# EAGLE design shield (EAGLE 6.6.0)
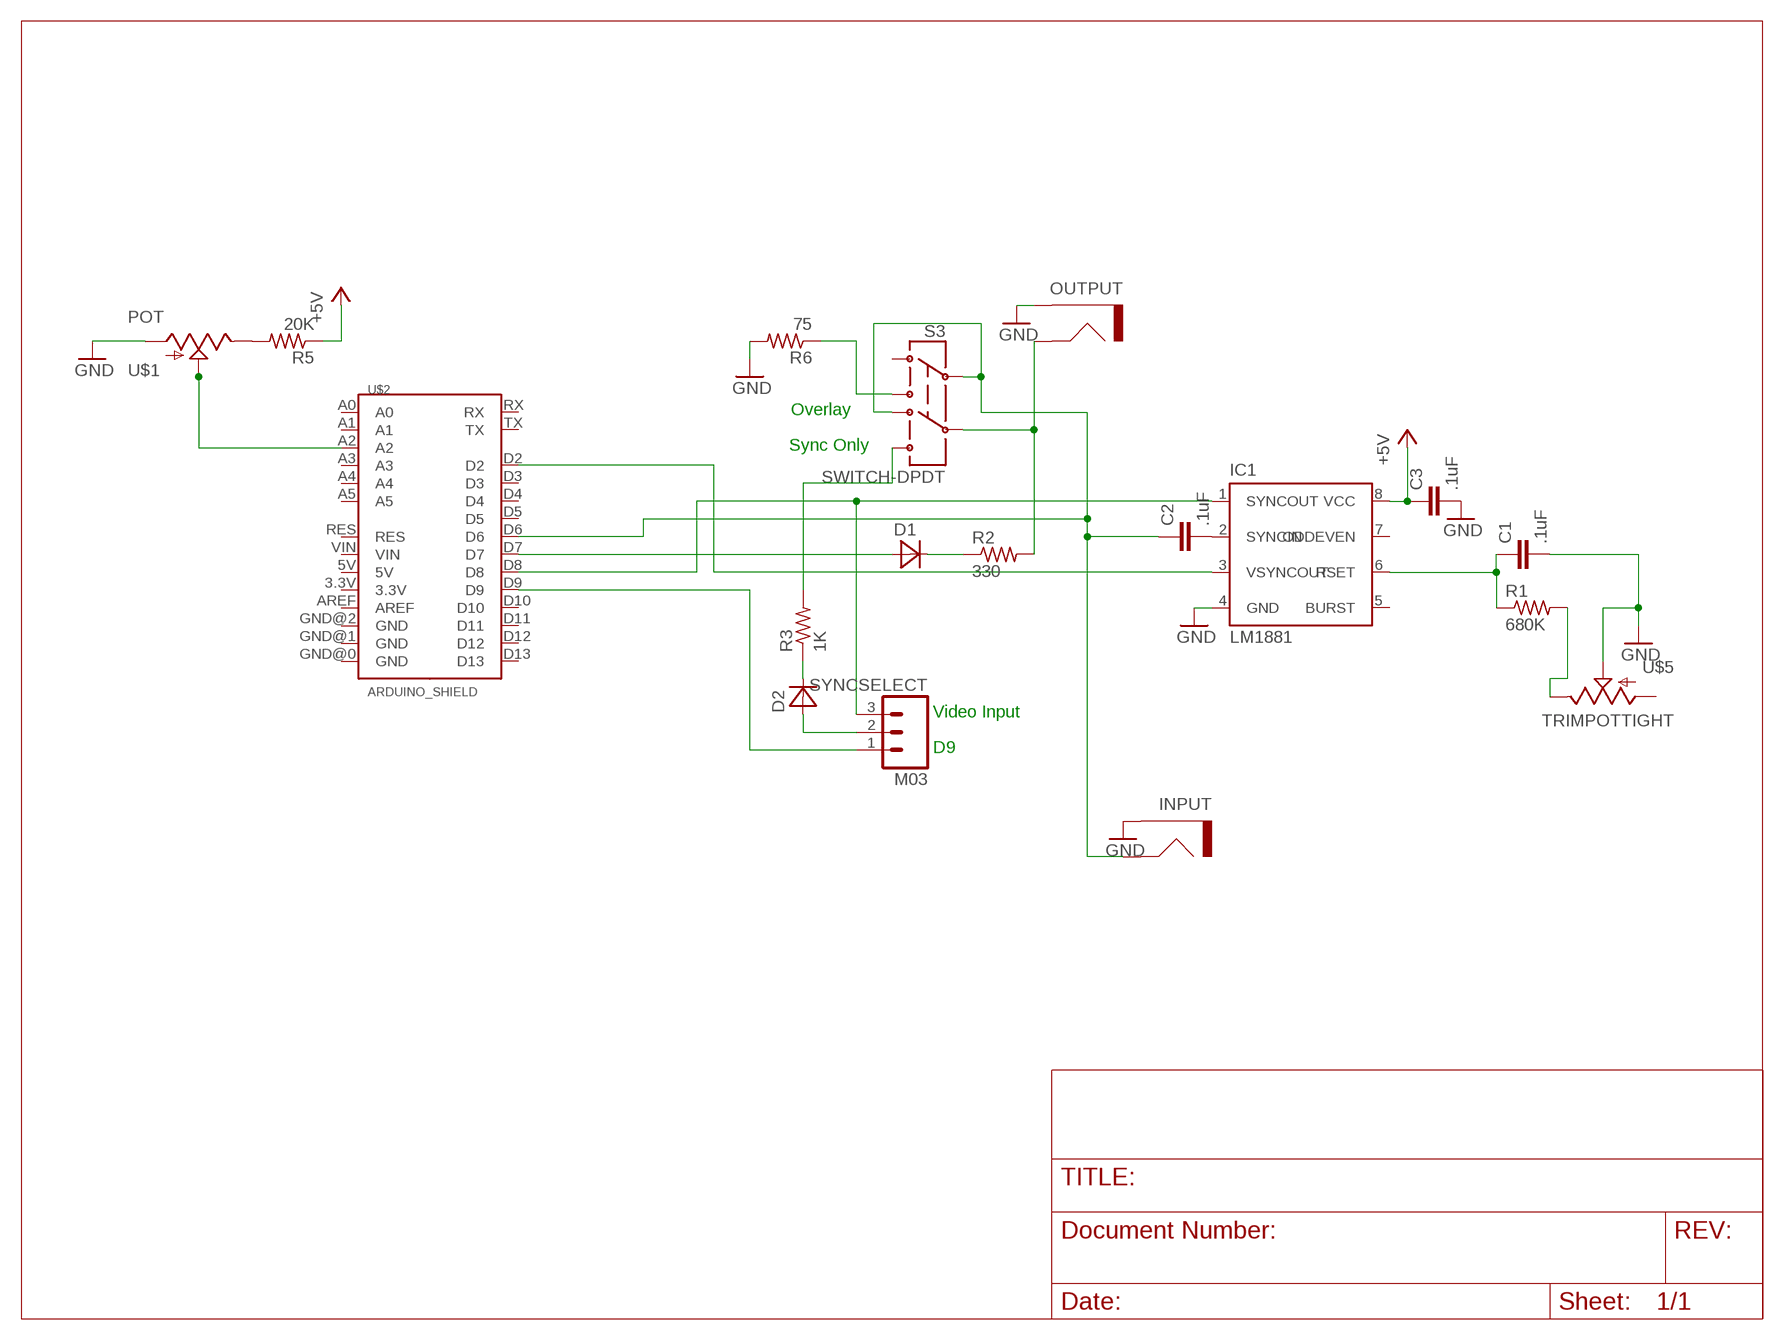
[diagram p0: schematic, sheet 1]
FRAME1 (LETTER_L): DRAWING_NAME: tidal-video-pulse

## Parts
C1  .1uF  CAPSMALL  [CAP-CERAMIC-SMALL]
C2  .1uF  CAPSMALL  [CAP-CERAMIC-SMALL]
C3  .1uF  CAPSMALL  [CAP-CERAMIC-SMALL]
D1  1N4148  [D35-10]
D2  1N4148  [D35-10]
IC1  LM1881  [DIL08]
INPUT  RCAJACK  [RCA]
OUTPUT  RCAJACK  [RCA]
R1  680K  R-US  [0207/10]
R2  330  R-US  [0207/10]
R3  1K  R-US  [0207/10]
R5  20K  R-US  [0207/10]
R6  75  R-US  [0207/10]
S3  SWITCH-DPDT  [OS]
SYNCSELECT  M03  [1X03]
U$1  POT  [TRIMMERPOT]
U$2  ARDUINO_SHIELD  [DUEMILANOVE_SHIELD]
U$5  TRIMPOTTIGHT  [TRIM_POT_TIGHT]

## Nets
+5V: C3.1 IC1.8(VCC) R5.1
A2: U$1.2(WIPER) U$1.4(WIPER) U$2.A2
D9: SYNCSELECT.1 U$2.D9
GND: C1.2 C3.2 IC1.4(GND) INPUT.BARREL(GND) OUTPUT.BARREL(GND) R6.2 U$1.1 U$5.2
N$1: R3.2 S3.6
N$2: R6.1 S3.3
N$3: D1.C R2.1
N$4: R1.2 U$5.3
N$5: R5.2 U$1.3
N$8: D2.C R3.1
N$13: D2.A SYNCSELECT.2
N$29: C2.2 IC1.2(SYNCIN)
RSET: C1.1 IC1.6(RSET) R1.1
SYNCOUT: IC1.1(SYNCOUT) SYNCSELECT.3 U$2.D8
VIDEOINPUT: C2.1 INPUT.P$2(SIGNAL) S3.2 S3.4 U$2.D6
VIDEOOUT: D1.A U$2.D7
VIDEOOUTPUT: OUTPUT.P$2(SIGNAL) R2.2 S3.5
VSYNC: IC1.3(VSYNCOUT) U$2.D2
Unconnected: IC1.5(BURST) IC1.7(ODDEVEN) S3.1 U$2.3.3V U$2.5V U$2.A0 U$2.A1 U$2.A3 U$2.A4 U$2.A5 U$2.AREF U$2.D3 U$2.D4 U$2.D5 U$2.D10 U$2.D11 U$2.D12 U$2.D13 U$2.GND@0(GND) U$2.GND@1(GND) U$2.GND@2(GND) U$2.RES U$2.RX U$2.TX U$2.VIN U$5.1

## Notes on the sheet
- Overlay
- Sync Only
- Video Input
- D9

## Library data of the parts
C1-C3 = nootropicdesign:CAP: Unpolarized capacitor
D1 D2 = nootropicdesign:1N4148
IC1 = lm1881:LM1881
INPUT OUTPUT = nootropicdesign:RCAJACK: RCA jack
R1-R3 R5 R6 = nootropicdesign:R-US: Resistor
S3 = nootropicdesign:SWITCH-DPDT: DPDT Version of the COM-00597
SYNCSELECT = nootropicdesign:M03
U$1 = nootropicdesign:POT
U$2 = nootropicdesign:ARDUINO_SHIELD
U$5 = nootropicdesign:TRIMPOT

## Board
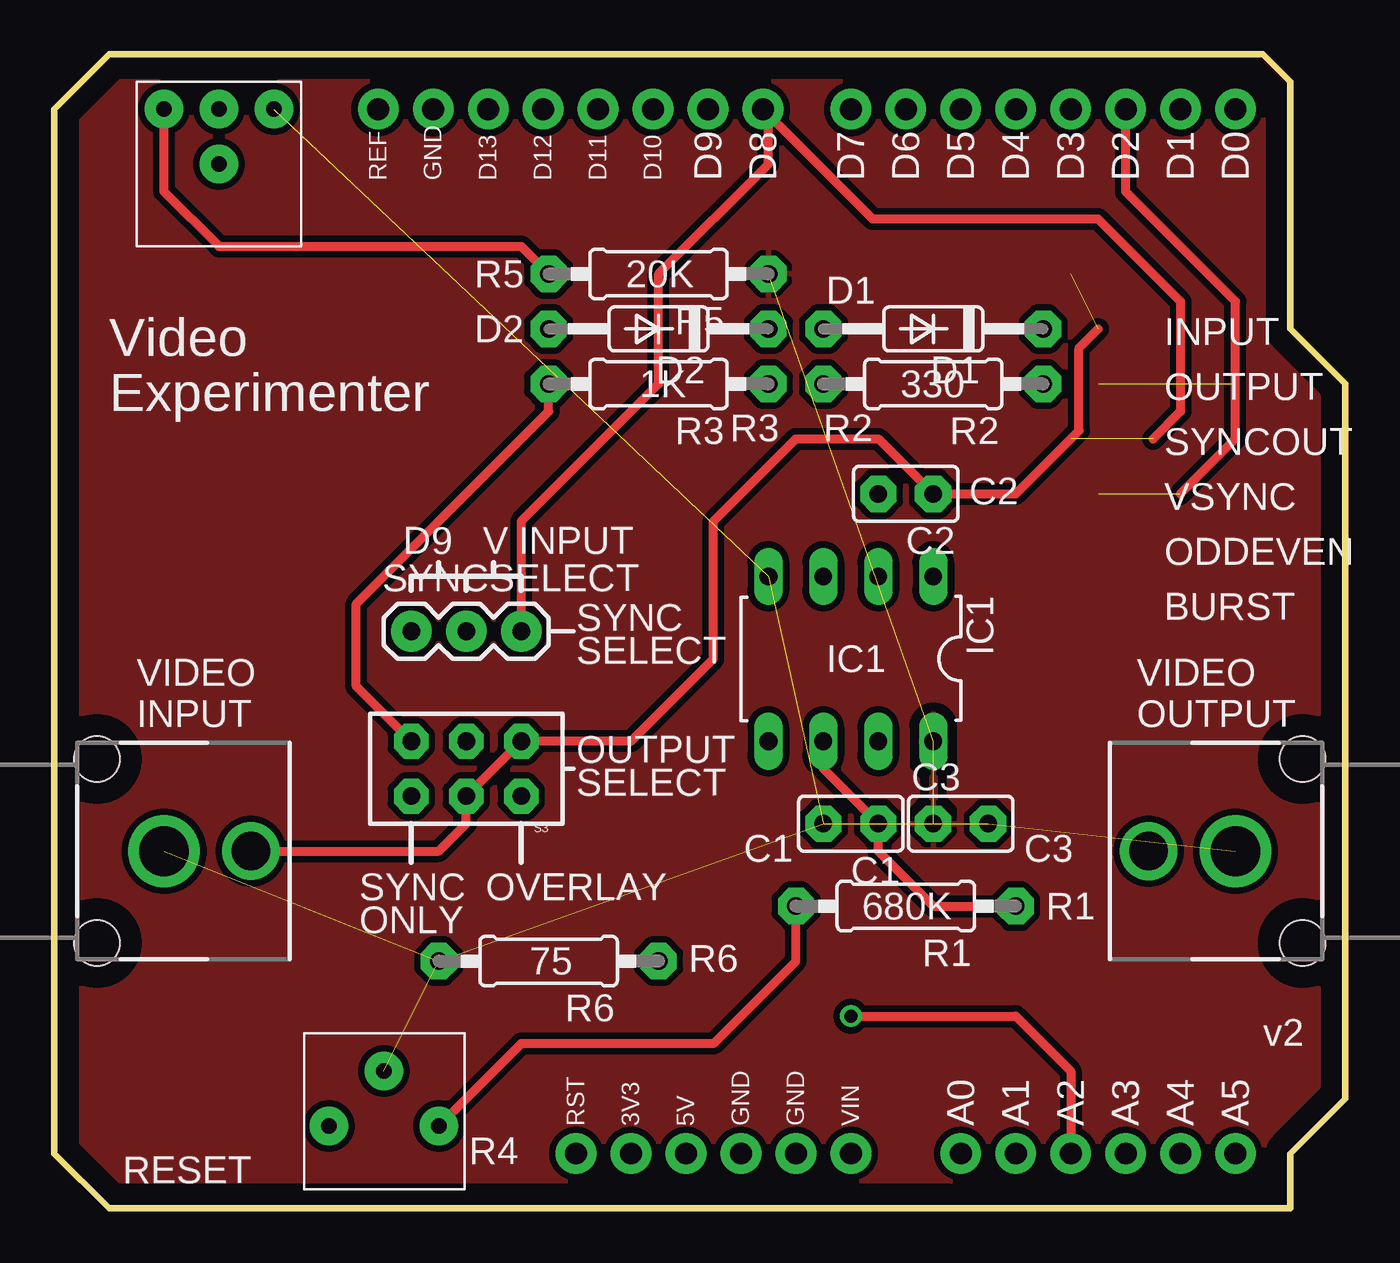
[diagram p1: board, top side]
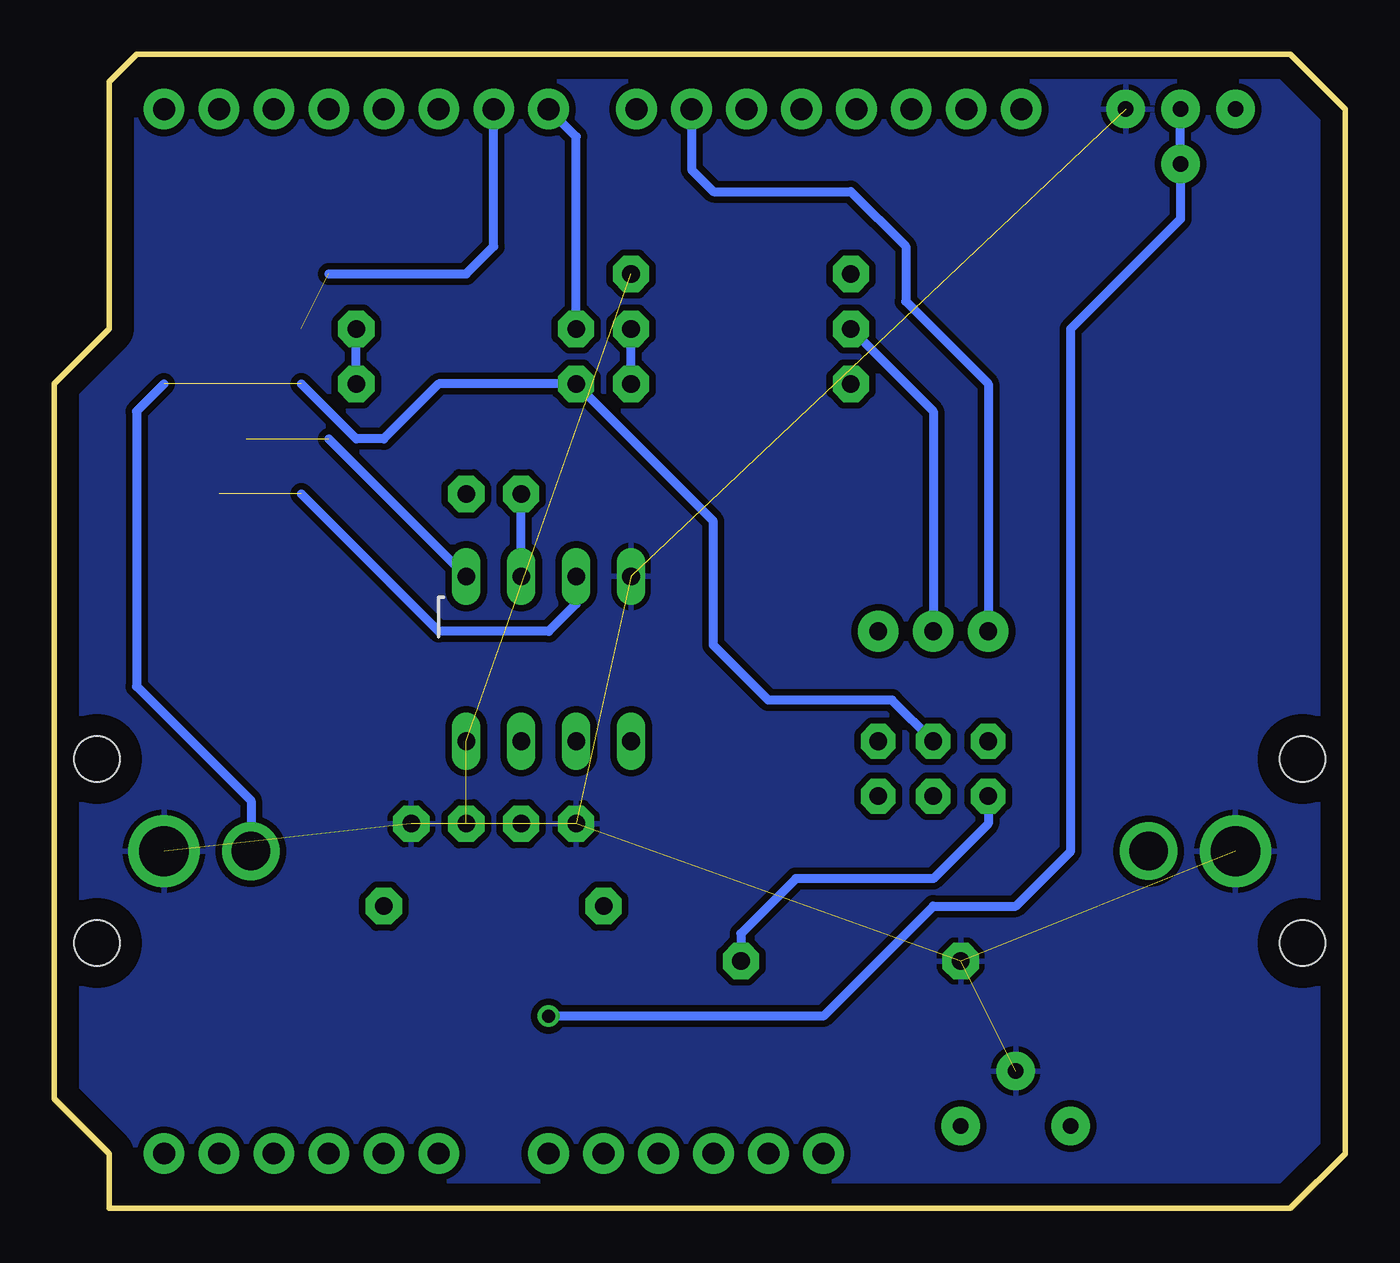
[diagram p2: board, bottom side, seen from below]

Size 59.69 x 53.34 mm. Coordinates in mm from the lower left corner, seen from the top.
Outline: 0,50.8 2.54,53.34 55.88,53.34 57.15,52.07 57.15,40.64 59.69,38.1 59.69,5.08 57.15,2.54 57.15,0 2.54,0 0,2.54 0,50.8
Copper layers (1*16): Top 0.035mm / dielectric 1.5mm / Bottom 0.035mm
Design rules "default *": minimum track width 10mil, minimum drill 20mil, track to track 12mil, track to pad 12mil, pad to pad 8mil, via to via 8mil, smd to smd 8mil, copper to edge 40mil, drill to drill 8mil, minimum pad ring 10mil, minimum via ring 8mil, stop-mask expansion 4mil, vias tented up to drill 0mil, thermal gap 10mil
tRestrict: 9 lines

### Footprints (pad centres in the part's own frame; a part is rotated, then mirrored left to right if it is on the bottom)
CAP-CERAMIC-SMALL = drill 0.813 pad 1.676 octagon: 1 -1.27,0; 2 1.27,0
D35-10 = drill 0.813 pad 1.676 octagon: A 5.08,0; C -5.08,0
DIL08 = drill 0.813 long: 1 -3.81,-3.81; 2 -1.27,-3.81; 3 1.27,-3.81; 4 3.81,-3.81; 5 3.81,3.81; 6 1.27,3.81; 7 -1.27,3.81; 8 -3.81,3.81
RCA = drill 2.3: BARREL 0,0 | drill 1.778 pad 2.54: P$2 4.02,0.002 | hole 2.1: -3.1,4.25; -3.1,-4.25
0207/10 = drill 0.813 pad 1.676 octagon: 1 -5.08,0; 2 5.08,0
OS = drill 0.813 pad 1.6 octagon: 1 -2.54,1.27; 2 0,1.27; 3 2.54,1.27; 4 -2.54,-1.27; 5 0,-1.27; 6 2.54,-1.27
1X03 = drill 0.813 pad 1.88: 1 -2.54,0; 2 0,0; 3 2.54,0
TRIMMERPOT = drill 0.711 pad 1.778: 1 2.54,-2.54; 2 2.54,0; 3 2.54,2.54; 4 0,0
DUEMILANOVE_SHIELD = drill 1.016 pad 1.88: 3.3V 26.67,2.54; 5V 29.21,2.54; A0 41.91,2.54; A1 44.45,2.54; A2 46.99,2.54; A3 49.53,2.54; A4 52.07,2.54; A5 54.61,2.54; AREF 14.986,50.8; D2 49.53,50.8; D3 46.99,50.8; D4 44.45,50.8; D5 41.91,50.8; D6 39.37,50.8; D7 36.83,50.8; D8 32.766,50.8; D9 30.226,50.8; D10 27.686,50.8; D11 25.146,50.8; D12 22.606,50.8; D13 20.066,50.8; GND@0 31.75,2.54; GND@1 34.29,2.54; GND@2 17.526,50.8; RES 24.13,2.54; RX 54.61,50.8; TX 52.07,50.8; VIN 36.83,2.54
TRIM_POT_TIGHT = drill 0.711 pad 1.778: 1 0,2.54; 2 2.54,0; 3 0,-2.54

### Placement (x,y rotation side)
C1  36.83,17.78 180 top
C2  39.37,33.02 180 top
C3  41.91,17.78 0 top
D1  40.64,40.64 180 top
D2  27.94,40.64 180 top
IC1  36.83,25.4 180 top
INPUT  5.08,16.51 0 top
OUTPUT  54.61,16.51 180 top
R1  39.37,13.97 180 top
R2  40.64,38.1 180 top
R3  27.94,38.1 180 top
R5  27.94,43.18 180 top
R6  22.86,11.43 180 top
S3  19.05,20.32 180 top
SYNCSELECT  19.05,26.67 0 top
U$1  7.62,48.26 90 top
U$2  0,0 0 top
U$5  15.24,3.81 90 top

### Tracks (layer width: path | path; a pad name or v marks a point on that pad's centre or on a via)
+5V  (2 unrouted)
  pour Top: 2.54,52.83 0.51,50.8 0.38,50.67 0.38,2.67 2.67,0.38 56.77,0.38 56.77,2.67 59.31,5.21 59.31,37.97 56.77,40.51 56.77,51.94 55.75,52.96 2.67,52.96
A2  (via drill 0.6)
  Top 0.406: v36.83,8.89 44.45,8.89 46.99,6.35 U$2.A2
  Bottom 0.406: U$1.2 U$1.4 7.62,45.72 12.7,40.64 12.7,16.51 15.24,13.97 19.05,13.97 24.13,8.89 v36.83,8.89
D9
  Bottom 0.406: U$2.D9 30.23,48.01 29.21,46.99 22.86,46.99 20.32,44.45 20.32,41.91 16.51,38.1 SYNCSELECT.1
GND  (7 unrouted)
  pour Bottom: 0.38,50.67 0.38,2.67 0.51,2.54 2.67,0.38 56.77,0.38 56.77,2.67 59.31,5.21 59.31,37.97 56.77,40.51 56.77,51.94 55.75,52.96 2.67,52.96
N$1
  Top 0.406: R3.2 22.86,36.83 13.97,27.94 13.97,24.13 S3.6
N$2
  Bottom 0.406: S3.3 16.51,17.78 19.05,15.24 25.4,15.24 27.94,12.7 R6.1
N$3
  Bottom 0.406: R2.1 D1.C
N$4
  Top 0.406: U$5.3 21.59,7.62 30.48,7.62 34.29,11.43 R1.2
N$5
  Top 0.406: U$1.3 5.08,46.99 7.62,44.45 21.59,44.45 R5.2
N$8
  Bottom 0.406: R3.1 D2.C
N$13
  Bottom 0.406: D2.A 19.05,36.83 SYNCSELECT.2
N$29
  Bottom 0.406: IC1.2 C2.2
RSET
  Top 0.406: IC1.6 35.56,20.32 C1.1 38.1,16.51 40.64,13.97 R1.1
SYNCOUT  (1 unrouted)
  Top 0.406: 50.8,35.56 52.07,36.83 52.07,41.91 48.26,45.72 37.85,45.72 U$2.D8 33.02,50.55 33.02,48.26 27.94,43.18 27.94,38.1 21.59,31.75 SYNCSELECT.3
  Bottom 0.406: 46.99,35.56 IC1.1
VIDEOINPUT  (1 unrouted)
  Top 0.406: INPUT.P$2 17.78,16.51 19.05,17.78 S3.2 S3.4 26.67,21.59 30.48,25.4 30.48,31.75 34.29,35.56 38.1,35.56 C2.1 44.45,33.02 47.37,35.94 47.37,39.75 48.26,40.64
  Bottom 0.406: 46.99,43.18 40.64,43.18 39.37,44.45 U$2.D6
VIDEOOUT
  Bottom 0.406: D1.A 35.56,49.53 U$2.D7
VIDEOOUTPUT  (1 unrouted)
  Bottom 0.406: 48.26,38.1 45.72,35.56 44.45,35.56 41.91,38.1 R2.2 29.21,31.75 29.21,26.04 26.67,23.5 20.95,23.5 S3.5 | OUTPUT.P$2 50.59,18.84 55.88,24.13 55.88,36.83 54.61,38.1
VSYNC  (1 unrouted)
  Top 0.406: 52.07,33.02 54.61,35.56 54.61,41.91 49.53,46.99 U$2.D2
  Bottom 0.406: IC1.3 35.56,27.94 36.83,26.67 41.91,26.67 48.26,33.02

### Text on the board
tPlace: R5 | 20K | D1 | D2 | INPUT | Video | Experimenter | 1K | 330 | OUTPUT | R3 | R2 | SYNCOUT | C2 | VSYNC | D9 | V | INPUT | ODDEVEN | SYNC | BURST | SELECT | IC1 | VIDEO | VIDEO | INPUT | OUTPUT | OUTPUT | SELECT | C1 | C3 | SYNC | OVERLAY | ONLY | 680K | R1 | 75 | R6 | v2 | R4 | RESET